# Altium schematic sheet Connectors.SchDoc
size A; DocumentNumber: 6; SheetNumber: 6; SheetTotal: 6
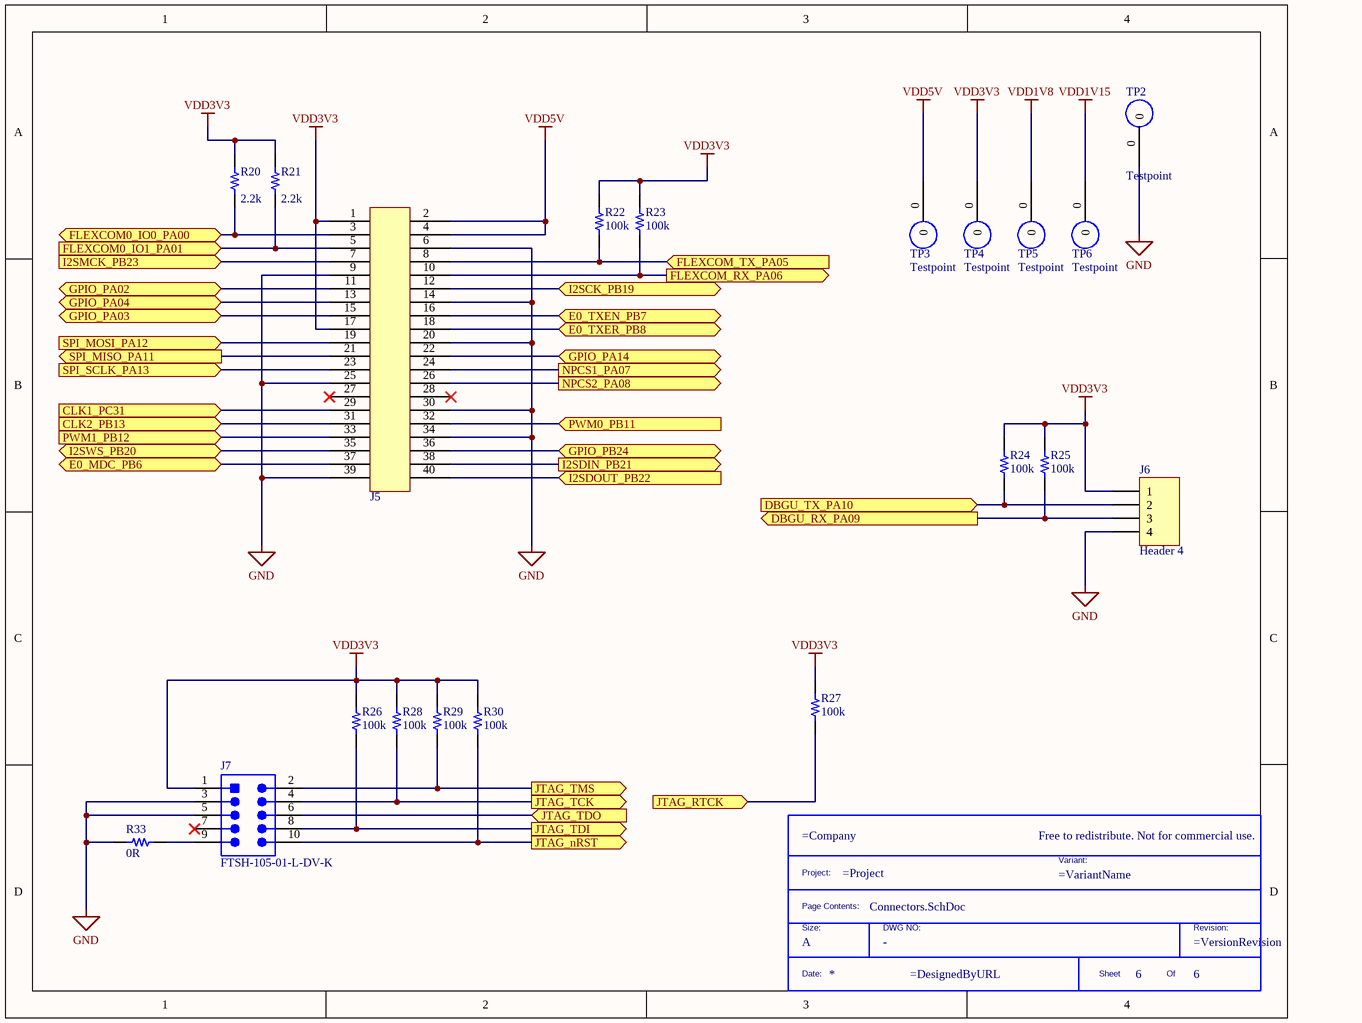
[diagram p0: Connectors.SchDoc]

## Parts
*  Size: A  (hidden comment: TitleBlock)  (graphical)
J5  DF23C-40DP-0.5V(92)  [DF23C-40DP-0.5V(92)]  (value not drawn)
J6  Header 4  [HDR1X4]
J7  FTSH-105-01-L-DV-K  [SMTC-FTSH-105-01-L-DV-K_V]
R20  2.2k  [RES 0402_1005]
R21  2.2k  [RES 0402_1005]
R22  100k  [RES 0402_1005]
R23  100k  [RES 0402_1005]
R24  100k  [RES 0402_1005]
R25  100k  [RES 0402_1005]
R26  100k  [RES 0402_1005]
R27  100k  [RES 0402_1005]
R28  100k  [RES 0402_1005]
R29  100k  [RES 0402_1005]
R30  100k  [RES 0402_1005]
R33  0R  [RES 0402_1005]
TP2  Testpoint  [Testpoint]  (no BOM)
TP3  Testpoint  [Testpoint]  (no BOM)
TP4  Testpoint  [Testpoint]  (no BOM)
TP5  Testpoint  [Testpoint]  (no BOM)
TP6  Testpoint  [Testpoint]  (no BOM)

## Ports
CLK1_PC31 (in), CLK2_PB13 (in), DBGU_RX_PA09 (out), DBGU_TX_PA10 (in), E0_MDC_PB6 (bidir), E0_TXEN_PB7 (bidir), E0_TXER_PB8 (bidir), FLEXCOM0_IO0_PA00 (bidir), FLEXCOM0_IO1_PA01 (in), FLEXCOM_RX_PA06 (out), FLEXCOM_TX_PA05 (in), GPIO_PA02 (bidir), GPIO_PA03 (bidir), GPIO_PA04 (bidir), GPIO_PA14 (bidir), GPIO_PB24 (bidir), I2SCK_PB19 (bidir), I2SDIN_PB21 (out), I2SDOUT_PB22 (in), I2SMCK_PB23 (in), I2SWS_PB20 (bidir), JTAG_nRST (out), JTAG_RTCK (in), JTAG_TCK (out), JTAG_TDI (out), JTAG_TDO (in), JTAG_TMS (out), NPCS1_PA07 (out), NPCS2_PA08 (out), PWM0_PB11 (in), PWM1_PB12 (in), SPI_MISO_PA11 (out), SPI_MOSI_PA12 (in), SPI_SCLK_PA13 (in)

## Nets
GND: J5.6 J5.9 J5.14 J5.20 J5.25 J5.30 J5.34 J5.39 J6.4 J7.3 J7.5 R33.2 TP2.0
VDD1V8: TP5.0
VDD1V15: TP6.0
VDD3V3: J5.1 J5.17 J6.1 J7.1 R20.2 R21.2 R22.2 R23.2 R24.2 R25.2 R26.2 R27.2 R28.2 R29.2 R30.2 TP4.0
VDD5V: J5.2 J5.4 TP3.0
CLK1_PC31: J5.29 ; port CLK1_PC31
CLK2_PB13: J5.31 ; port CLK2_PB13
DBGU_RX_PA09: J6.3 R25.1 ; port DBGU_RX_PA09
DBGU_TX_PA10: J6.2 R24.1 ; port DBGU_TX_PA10
E0_MDC_PB6: J5.37 ; port E0_MDC_PB6
E0_TXEN_PB7: J5.16 ; port E0_TXEN_PB7
E0_TXER_PB8: J5.18 ; port E0_TXER_PB8
FLEXCOM0_IO0_PA00: J5.3 R20.1 ; port FLEXCOM0_IO0_PA00
FLEXCOM0_IO1_PA01: J5.5 R21.1 ; port FLEXCOM0_IO1_PA01
FLEXCOM_RX_PA06: J5.10 R23.1 ; port FLEXCOM_RX_PA06
FLEXCOM_TX_PA05: J5.8 R22.1 ; port FLEXCOM_TX_PA05
GPIO_PA02: J5.11 ; port GPIO_PA02
GPIO_PA03: J5.15 ; port GPIO_PA03
GPIO_PA04: J5.13 ; port GPIO_PA04
GPIO_PA14: J5.22 ; port GPIO_PA14
GPIO_PB24: J5.36 ; port GPIO_PB24
I2SCK_PB19: J5.12 ; port I2SCK_PB19
I2SDIN_PB21: J5.38 ; port I2SDIN_PB21
I2SDOUT_PB22: J5.40 ; port I2SDOUT_PB22
I2SMCK_PB23: J5.7 ; port I2SMCK_PB23
I2SWS_PB20: J5.35 ; port I2SWS_PB20
JTAG_nRST: J7.10 R30.1 ; port JTAG_nRST
JTAG_RTCK: R27.1 ; port JTAG_RTCK
JTAG_TCK: J7.4 R28.1 ; port JTAG_TCK
JTAG_TDI: J7.8 R26.1 ; port JTAG_TDI
JTAG_TDO: J7.6 ; port JTAG_TDO
JTAG_TMS: J7.2 R29.1 ; port JTAG_TMS
NPCS1_PA07: J5.24 ; port NPCS1_PA07
NPCS2_PA08: J5.26 ; port NPCS2_PA08
PWM0_PB11: J5.32 ; port PWM0_PB11
PWM1_PB12: J5.33 ; port PWM1_PB12
SPI_MISO_PA11: J5.21 ; port SPI_MISO_PA11
SPI_MOSI_PA12: J5.19 ; port SPI_MOSI_PA12
SPI_SCLK_PA13: J5.23 ; port SPI_SCLK_PA13
NetJ7_9: J7.9 R33.1

Not connected (* = marked no-connect by the designer): J5 27* 28*; J7 7*

## Notes on the sheet
- (in symbol TitleBlock) Free to redistribute. Not for commercial use.; Project:; Variant:; Page Contents:; Size:; DWG NO:; Revision:; Date:; Sheet; Of

## Library data of the parts
* = TitleBlock: Custom Title Block; DWG: -
J5 = DF23C-40DP-0.5V(92): 0.5mm Pitch Low-Profile (H=1.5mm) Board to Board / FPC to Board Connectors; Manufacturer: Hirose; Connector Type: Plug,PCB; Number of Positions: 40; Current Rating: 300mA; Voltage Rating: 50V; Insulation Resistance: 500MR; Gender: Male; Mated Stacking Heights: 1.5mm; Row Spacing: 4.3mm; Supplier 1: Digi-Key; Manufacturer Part Number: DF23C-40DP-0.5V(92); RoHS: Yes; Category: Headers and Wire Housings; Stock 1: 419; Pricing 1: 1=1.25000, 10=1.09700, 25=1.03200, 50=0.98900, 100=0.94600, 250=0.86000, 500=0.77400, 1000=0.68800 (USD); Mount: Surface Mount; Contact Plating: Gold; Contact Material: Bronze,Copper Alloy; Housing Color: Black; Housing Material: Polymer; Min Operating Temperature: -35°C; Max Operating Temperature: 85°C; Package Quantity: 2000; Number of Rows: 2; Packaging: Tape and Reel; Number of Contacts: 40; Series: DF23; Contact Gender: Male; Termination: SMD/SMT; Orientation: Straight; Pitch: 0.5mm; Lead Free: Lead Free; REACH SVHC: No SVHC; Flammability Rating: UL94 V-0; RoHS Compliant: Yes; ComponentLink1URL: https://datasheet.ciiva.com/11751/0900766b80f5fb65-11751775.pdf?src-supplier=RSComponents; ComponentLink1Description: https://datasheet.ciiva.com/11751/0900766b80f5fb65-11751775.pdf?src-supplier=RSComponents; ComponentLink2URL: https://datasheet.ciiva.com/397/e68801060-397924.pdf?src-supplier=Digi-Key; ComponentLink2Description: https://datasheet.ciiva.com/397/e68801060-397924.pdf?src-supplier=Digi-Key; ComponentLink3URL: https://datasheet.ciiva.com/13568/e68801060-16897-13568044.pdf?src-supplier=Mouser; ComponentLink3Description: https://datasheet.ciiva.com/13568/e68801060-16897-13568044.pdf?src-supplier=Mouser; ComponentLink4URL: https://datasheet.ciiva.com/8038/e68801060-8038886.pdf?src-supplier=Element14; ComponentLink4Description: https://datasheet.ciiva.com/8038/e68801060-8038886.pdf?src-supplier=Element14; Supplier Part Number 1: H124750CT-ND
J6 = Header 4: Header, 4-Pin; LatestRevisionDate: 17-Jul-2002; LatestRevisionNote: Re-released for DXP Platform.; Publisher: Altium Limited
J7 = CMP-2000-05353-1: Male Header, Pitch 1.27 mm, 2 x 5 Position, Height 6.25 mm; Manufacturer: Samtec; Pitch: 0.050"(1.27mm); Other Names: Q3937619; Number of Positions: 10; Mating Products: SFMC-105-L2-S-D-TR-ND / -CONN.05"SURFACE10POSSMT / FLE-105-01-G-DV-TR-ND / -CONNSKT1.27MM10POSDUALSMD / FLE-105-01-G-DV-A-P-ND / -CONNSKT1.27MM10POSDUALSMD / FLE-105-01-G-DV-A-ND / -CONNSKT1.27MM10POSDUALSMD / CLP-105-02-G-D-P-TR-ND / -CONNRCPT10POSDUAL.05"SMD / SAM1155-05-ND / -CONNRCPT10POSDUAL.05"SMD / SAM1154-05-ND / -CONNRCPT10POSDUAL.05"SMD / SAM1153-05-ND / -CONNRCPT10POSDUAL.05"SMD / SAM1226-05-ND / -CONNRCPT.05"10POSDUALSMD; Number of Positions Loaded: All; Connector Type: Header,Unshrouded; Product Training Modules: Board-to-BoardConnectors; Datasheet Version: Rev. ET, 10/1995; Number of Rows: 2; Standard Package: 1; Package Description: Male Header, Pitch 1.27 mm, 2 x 5 Position, Height 5.97 mm, Tail Length 4.32 mm; Contact Finish Thickness: 10µin(0.25µm); Series: FTSH; Termination: Solder; Contact Type: MalePin; Color: Black; Package Reference: FTSH-105-01-L-DV-K; Family: RectangularConnectors-Headers,MalePins; Package URL: http://suddendocs.samtec.com/prints/ftsh-1xx-xx-xxx-dv-xxx-footprint.pdf; Packaging: Tube; Mounting Type: SurfaceMount; Category: Connectors,Interconnects; Datasheet URL: http://suddendocs.samtec.com/prints/ftsh-1xx-xx-xxx-dv-xxx-mkt.pdf; Row Spacing: 0.050"(1.27mm); Manufacturer URL: http://www.samtec.com/; Contact Mating Length: 0.120"(3.05mm); Contact Finish: Gold
R20 R21 = RCS04022K20FKED: RES SMD 2.2K OHM 1% 1/5W 0402; Part Number: RCS04022K20FKED; Value: 2.2k
R22-R30 = CRCW0402100KFKEDC: RES SMD 100K OHM 1% 1/16W 0402; Manufacturer: Vishay Dale; Power (Watts): 0.063W, 1/16W; Resistance: 100 kOhms; Temperature Coefficient: ±100ppm/°C; Part Number: CRCW0402100KFKEDC; Value: 100k; ComponentLink1Description: Datasheet; ComponentLink1URL: http://www.vishay.com/docs/28773/crcwce3.pdf; ComponentLink2Description: DigiKey Link; ComponentLink2URL: http://digikey.com/product-detail/en/vishay-dale/CRCW0402100KFKEDC/541-3960-1-ND/7928643; Composition: Thick Film; Device Package: 0402 (1005 Metric); Height - Seated (Max): 0.014" (0.35mm); LastUpdated: 9/2/2020 1:07:49 AM; Lifecycle Status: Active; Minimum Order: 1; Number of Terminations: 2; Operating Temperature: -55°C ~ 155°C; Package / Case: 0402 (1005 Metric); Packaging: CutTape; PartId: 12665; Part Status: Active; Price: 0.10; Series: CRCW-C; Size / Dimension: 0.039" L x 0.020" W (1.00mm x 0.50mm); Supplier 1: DigiKey; Supplier Part Number 1: 541-3960-1-ND; Supplier Device Package: 0402; Tolerance: ±1%
R33 = CRG0402ZR: RES SMD 0 OHM JUMPER 1/16W 0402; Manufacturer: TE Connectivity Passive Product; Power (Watts): 0.063W, 1/16W; Part Number: CRG0402ZR; ComponentLink1Description: Datasheet; ComponentLink1URL: https://www.te.com/commerce/DocumentDelivery/DDEController?Action=srchrtrv&DocNm=1773204&DocType=DS&DocLang=English; ComponentLink2Description: DigiKey Link; ComponentLink2URL: http://digikey.com/product-detail/en/te-connectivity-passive-product/CRG0402ZR/A106025CT-ND/3477649; Composition: Thick Film; Device Package: 0402 (1005 Metric); Height - Seated (Max): 0.016" (0.40mm); LastUpdated: 9/2/2020 1:07:28 AM; Lifecycle Status: Active; Minimum Order: 1; Number of Terminations: 2; Operating Temperature: -55°C ~ 155°C; Package / Case: 0402 (1005 Metric); Packaging: CutTape; PartId: 20614; Part Status: Active; Price: 0.10; Series: CRG, Neohm; Size / Dimension: 0.039" L x 0.020" W (1.00mm x 0.50mm); Supplier 1: DigiKey; Supplier Part Number 1: A106025CT-ND; Supplier Device Package: 0402; Tolerance: Jumper; Value: 0R